# Altium schematic sheet ALLPRINT-CAPBOARD-677512-ISO-PGM.SchDoc
size A3; Organization: Altium Limited; Address1: 3 Minna Close; Address2: Belrose; Address3: NSW 2085; Address4: Australia; DocumentNumber: 13; SheetNumber: 11; SheetTotal: 11
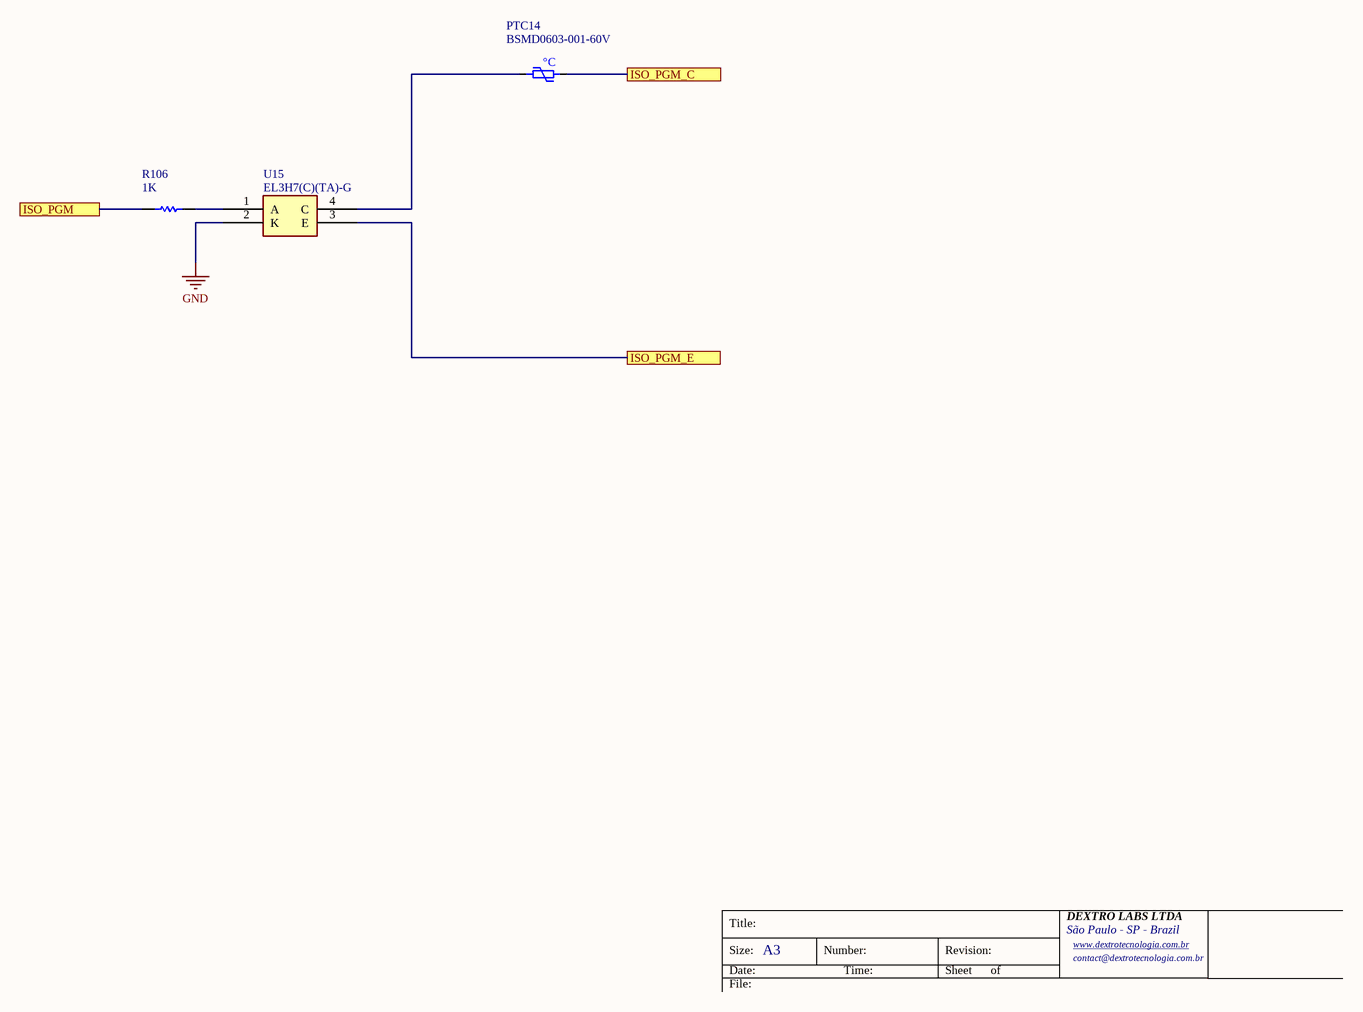
[diagram p0: ALLPRINT-CAPBOARD-677512-ISO-PGM.SchDoc]

## Parts
PTC14  BSMD0603-001-60V  [PTC-0603]
R106  1K  [RES-0603]
U15  EL3H7(C)(TA)-G  [SSOP-4]

## Ports
ISO_PGM (see ALLPRINT-CAPBOARD-677512-GENERAL[3C], ALLPRINT-CAPBOARD-677512-MCU[1B]), ISO_PGM_C (see ALLPRINT-CAPBOARD-677512-GENERAL[4C]), ISO_PGM_E (see ALLPRINT-CAPBOARD-677512-GENERAL[4C])

## Nets
GND: U15.2(K)
ISO_PGM: R106.1 ; port ISO_PGM
ISO_PGM_C: PTC14.2 ; port ISO_PGM_C
ISO_PGM_E: U15.3(E) ; port ISO_PGM_E
NetPTC14_1: PTC14.1 U15.4(C)
NetR106_2: R106.2 U15.1(A)

## Notes on the sheet
- Title:
- Size:
- Date:
- A3
- Number:
- Time:
- Revision:
- Sheet
- of
- DEXTRO LABS LTDA
- São Paulo - SP - Brazil
- www.dextrotecnologia.com.br <http://www.dextrotecnologia.com.br>
- contact@dextrotecnologia.com.br
- File:
- (in symbol PTC-FUSE-60V-10mA-0603) °C

## Library data of the parts
PTC14 = PTC-FUSE-60V-10mA-0603: 60V 10mA 20A 50mA 15Ω 0603 PTC Resettable Fuses ROHS; LCSC: C914088
R106 = RES-1K-1%-100mW-0603: 100mW Thick Film Resistor 75V ±100ppm/℃ ±1% 1kΩ 0603 Chip Resistor - Surface Mount ROHS; LCSC: C22548
U15 = EL3H7(C)(TA)-G: 80V 3.75kV 50mA 200mV@10mA,1mA 6V 1.2V DC SSOP-4-1.27mm Transistor, Photovoltaic Output Optoisolators ROHS; LCSC: C92243